# EasyEDA Pro project Flight Track V2.epro

# Schematic Schematic1
Board Name: Board1; Create Date: 2025-07-31; Page Name: P1_1; Project Name: RC Plane Flight Computer V2; Schematic Name: Schematic1; Update Date: 2025-07-31; Company: EasyEDA.com; Page Size: A4; Version: V1.0
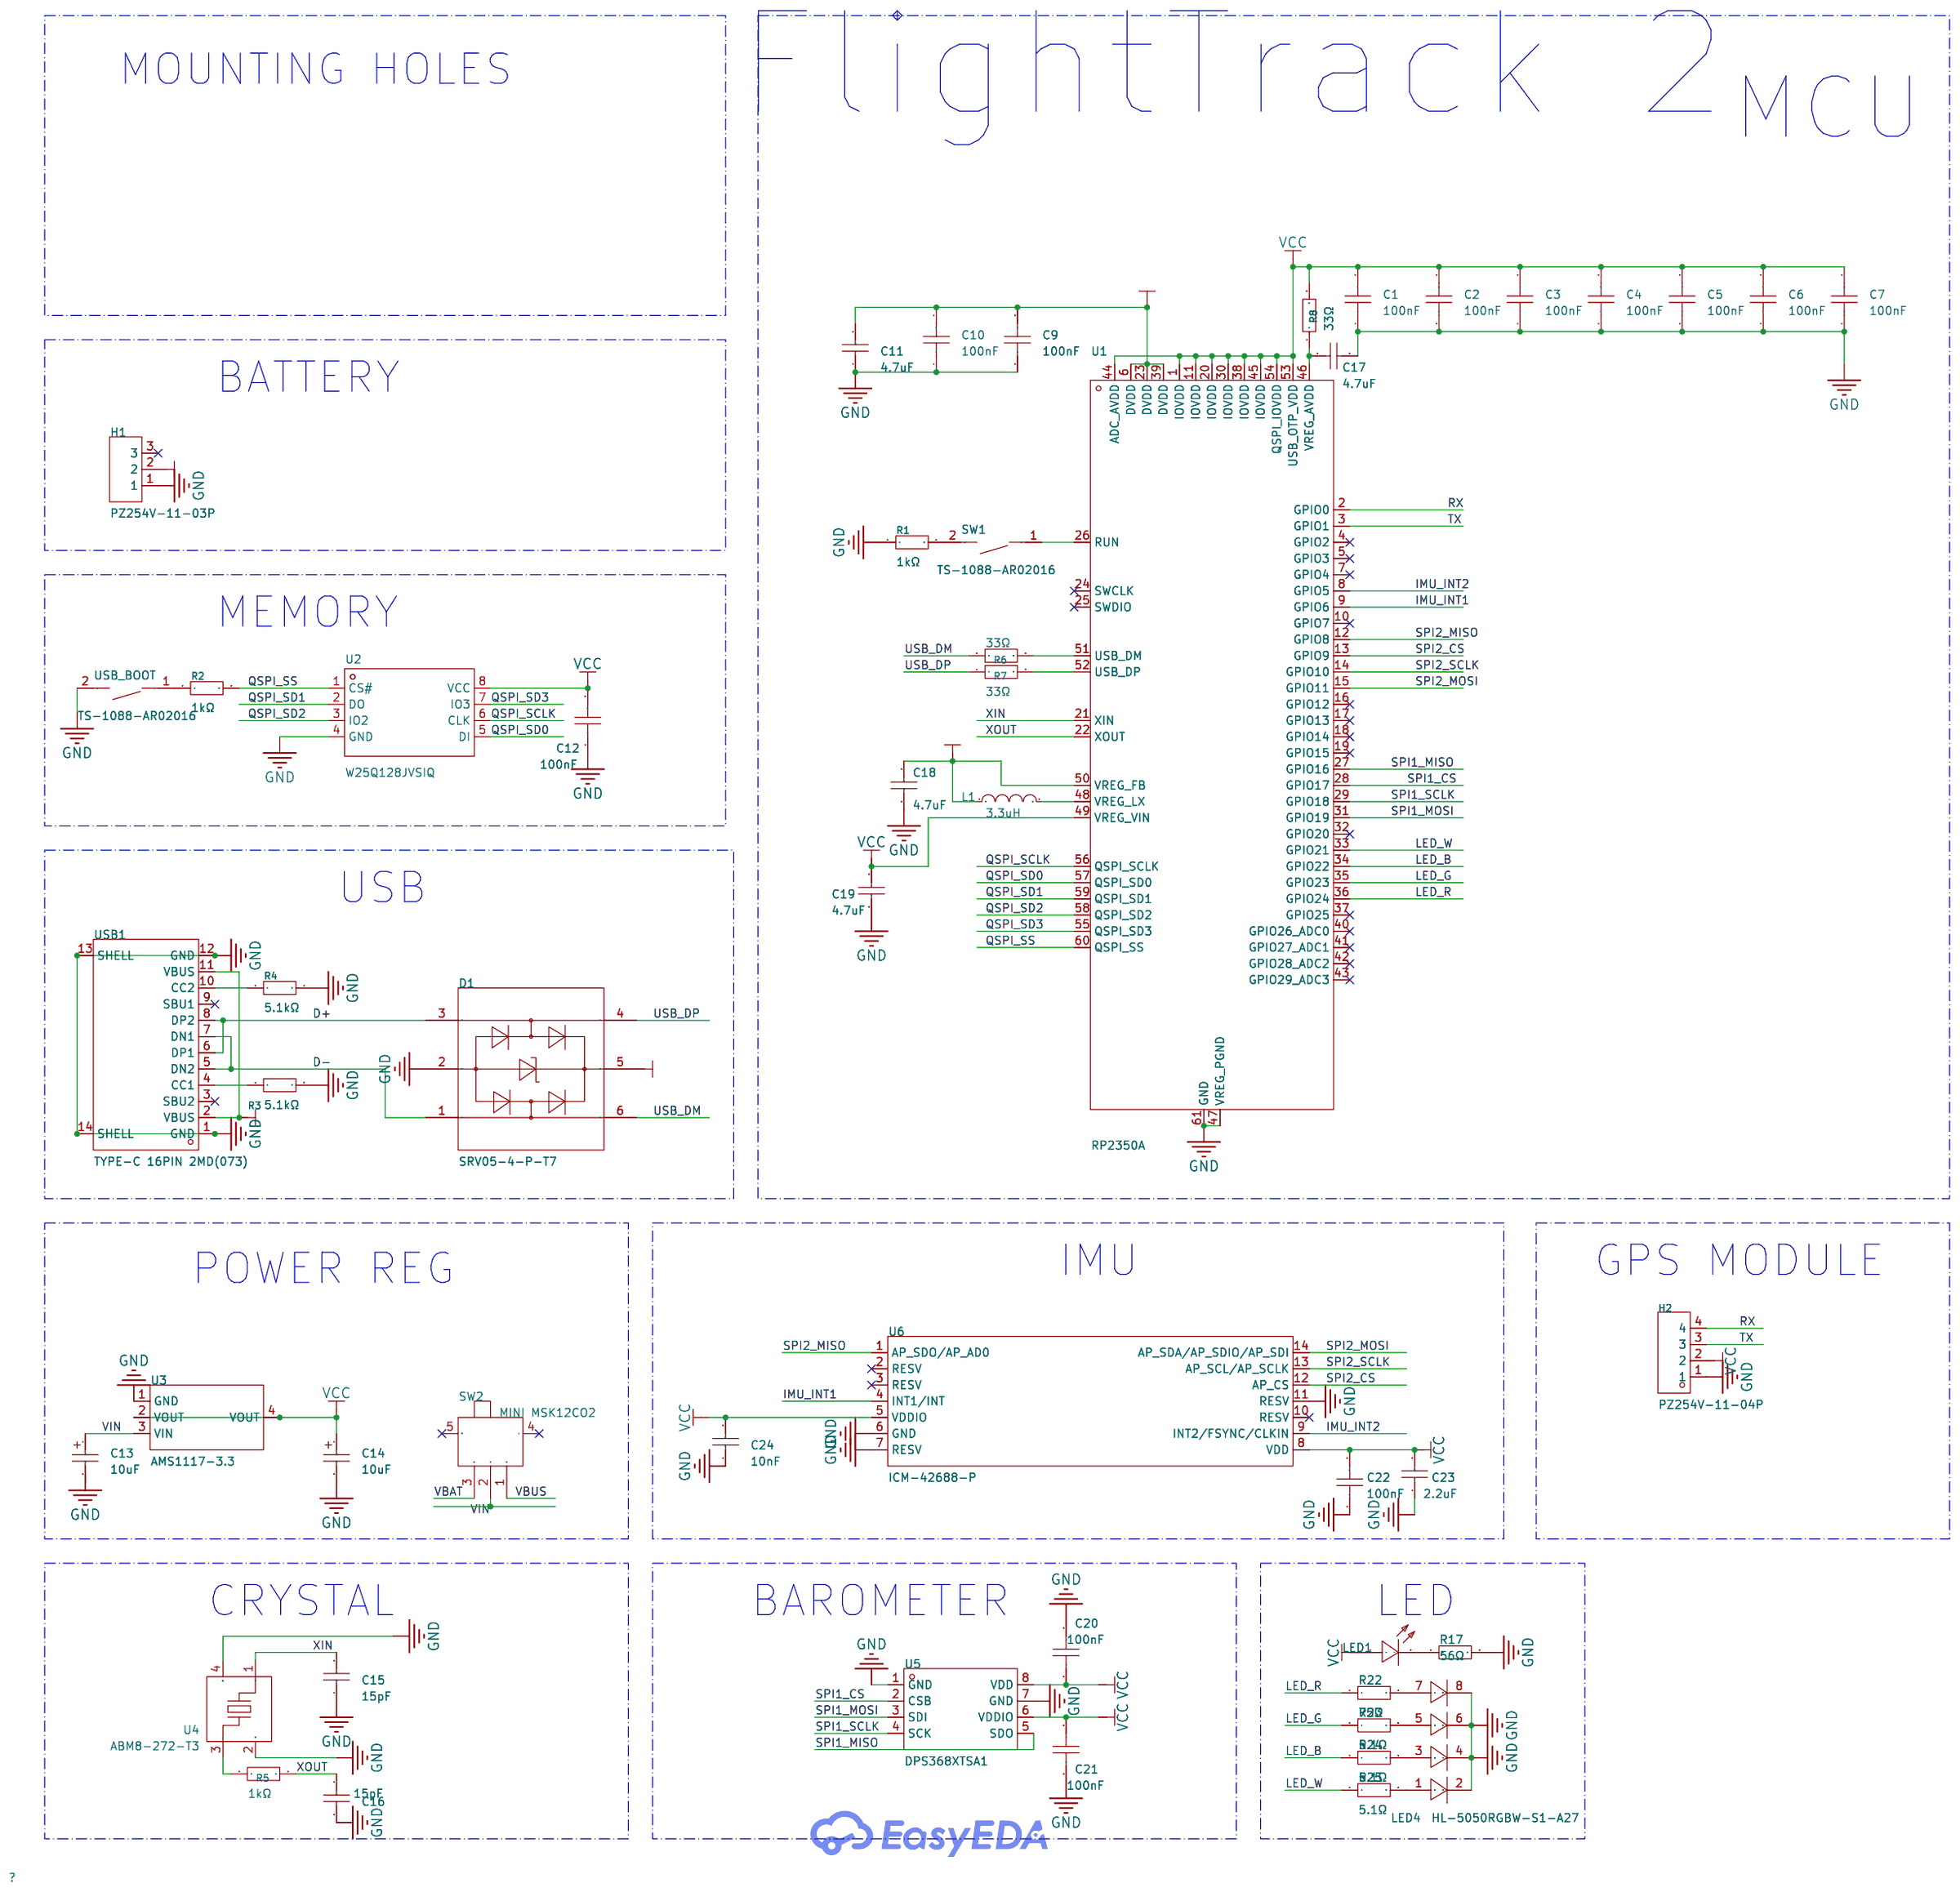
[diagram p0: schematic sheet]

## Parts
C1  100nF  [C0402]
C2  100nF  [C0402]
C3  100nF  [C0402]
C4  100nF  [C0402]
C5  100nF  [C0402]
C6  100nF  [C0402]
C7  100nF  [C0402]
C9  100nF  [C0402]
C10  100nF  [C0402]
C11  4.7uF  [C0805]
C12  100nF  [C0603]
C13  10uF  [CAP-SMD_L3.2-W1.6-RD-C7171]
C14  10uF  [CAP-SMD_L3.2-W1.6-RD-C7171]
C15  15pF  [C0402]
C16  15pF  [C0402]
C17  4.7uF  [C0805]
C18  4.7uF  [C0805]
C19  4.7uF  [C0805]
C20  100nF  [C0402]
C21  100nF  [C0402]
C22  100nF  [C0402]
C23  2.2uF  [C0603]
C24  10nF  [C0402]
D1  SRV05-4-P-T7  [SOT-23-6_L2.9-W1.6-P0.95-LS2.8-BR]
H1  PZ254V-11-03P  [HDR-TH_3P-P2.54-V-M]
H2  PZ254V-11-04P  [HDR-TH_4P-P2.54-V-M]
L1  3.3uH  [L0603]
LED1  NCD0805R1  [LED0805-R-RD]
LED4  HL-5050RGBW-S1-A27  [LED-SMD_8P-L5.0-W5.0-P1.20_HL-5050RGBW-S1-A27]
R1  1kΩ  [R0402]
R2  1kΩ  [R0402]
R3  5.1kΩ  [R0402]
R4  5.1kΩ  [R0402]
R5  1kΩ  [R0402]
R6  33Ω  [R0402]
R7  33Ω  [R0402]
R8  33Ω  [R0402]
R17  56Ω  [R0603]
R22  75Ω  [R0603]
R23  5.1Ω  [R0603]
R24  5.1Ω  [R0603]
R25  5.1Ω  [R0603]
SW1  TS-1088-AR02016  [SW-SMD_L3.9-W3.0-P4.45]
SW2  MINI MSK12CO2  [SW-SMD_MSK12CO2]
U1  RP2350A  [QFN-60_L7.0-W7.0-P0.40-TL-EP3.4]
U2  W25Q128JVSIQ  [SOIC-8_L5.3-W5.3-P1.27-LS8.0-BL]
U3  AMS1117-3.3  [SOT-223-3_L6.5-W3.4-P2.30-LS7.0-BR]
U4  ABM8-272-T3  [CRYSTAL-SMD_4P-L3.2-W2.5-BL]
U5  DPS368XTSA1  [LGA-8_L2.5-W2.0-P0.65-TR_DPS368]
U6  ICM-42688-P  [LGA-14_L3.0-W2.5-P0.50-TL]
USB1  TYPE-C 16PIN 2MD(073)  [USB-C-SMD_TYPE-C-6PIN-2MD-073]
USB_BOOT  TS-1088-AR02016  [SW-SMD_L3.9-W3.0-P4.45]

## Library data of the parts
C1-C7 C9 C10 C20-C22 = CL05B104KO5NNNC: Capacitance: Tolerance:±10% Tolerance:±10% Voltage Rated: Temperature Coefficient:; LCSC Part Name: 100nF ±10% 16V; Supplier Part: C1525; Manufacturer: SAMSUNG(三星); Supplier Footprint: 0402; JLCPCB Part Class: Basic Part; Datasheet: https://atta.szlcsc.com/upload/public/pdf/source/20160218/1457707763339.pdf; Supplier: LCSC; Tolerance: ±10%
C11 C17-C19 = CL21A475KAQNNNE: Capacitance: Tolerance:±10% Tolerance:±10% Voltage Rated: Temperature Coefficient:; LCSC Part Name: 4.7uF ±10% 25V; Supplier Part: C1779; Manufacturer: SAMSUNG(三星); Supplier Footprint: 0805; JLCPCB Part Class: Basic Part; Datasheet: https://atta.szlcsc.com/upload/public/pdf/source/20160218/1457707763339.pdf; Supplier: LCSC; Tolerance: ±10%
C12 = CC0603KRX7R9BB104: Capacitance:100nF Tolerance:±10% Tolerance:±10% Voltage Rating:50V Temperature Coefficient:X7R; LCSC Part Name: 100nF ±10% 50V; Supplier Part: C14663; Manufacturer: YAGEO(国巨); Supplier Footprint: 0603; JLCPCB Part Class: Basic Part; Datasheet: https://atta.szlcsc.com/upload/public/pdf/source/20250214/096C4C206003071F5D32E5F0D8E7F8DF.pdf; Supplier: LCSC; Tolerance: ±10%; Voltage Rating: 50V; Temperature Coefficient: X7R
C13 C14 = TAJA106K016RNJ: Capacitance:10uF Tolerance:±10% Tolerance:±10% Voltage Rating:16V Equivalent Series Resistance(ESR):3Ω@100kHz Operating Temperature:-55℃~+125℃ Operating Temperature:-55℃~+125℃; LCSC Part Name: 10uF ±10% 16V; Supplier Part: C7171; Manufacturer: Kyocera AVX; Supplier Footprint: CASE-A-3216-18(mm); JLCPCB Part Class: Basic Part; Supplier: LCSC; Tolerance: ±10%; Voltage Rating: 16V; Equivalent Series Resistance(ESR): 3Ω@100kHz; Operating Temperature: -55℃~+125℃
C15 C16 = 0402CG150J500NT: Capacitance: Tolerance:±5% Tolerance:±5% Voltage Rated: Temperature Coefficient:; LCSC Part Name: 15pF ±5% 50V; Supplier Part: C1548; Manufacturer: FH(风华); Supplier Footprint: 0402; JLCPCB Part Class: Basic Part; Datasheet: https://atta.szlcsc.com/upload/public/pdf/source/20200305/C486355_26A10D38EF8C2A5C37091D0039909270.pdf; Supplier: LCSC; Tolerance: ±5%
C23 = CL10A225KO8NNNC: Capacitance: Tolerance:±10% Tolerance:±10% Voltage Rated: Temperature Coefficient:; LCSC Part Name: 2.2uF ±10% 16V; Supplier Part: C23630; Manufacturer: SAMSUNG(三星); Supplier Footprint: 0603; JLCPCB Part Class: Basic Part; Datasheet: https://atta.szlcsc.com/upload/public/pdf/source/20160218/1457707763339.pdf; Supplier: LCSC; Tolerance: ±10%
C24 = CL05B103KB5NNNC: Capacitance: Tolerance:±10% Tolerance:±10% Voltage Rated: Temperature Coefficient:; LCSC Part Name: 10nF ±10% 50V; Supplier Part: C15195; Manufacturer: SAMSUNG(三星); Supplier Footprint: 0402; JLCPCB Part Class: Basic Part; Datasheet: https://atta.szlcsc.com/upload/public/pdf/source/20160218/1457707763339.pdf; Supplier: LCSC; Tolerance: ±10%
D1 = SRV05-4-P-T7_C19829547: Supplier Part: C19829547; Manufacturer: TECH PUBLIC(台舟); Supplier Footprint: SOT-23-6; JLCPCB Part Class: Extended Part; Datasheet: https://atta.szlcsc.com/upload/public/pdf/source/20240119/64597E192DDDD3DD737332EA0EAB363F.pdf; Supplier: LCSC
H1 = PZ254V-11-03P: Pin Structure:1x3P Pitch:2.54mm Row Spacing:- Circluar Pins/Square Pins:Policy Mounting Type:Straight Number of Rows:Single Row Number of Pins:3P Current Rating:3A Voltage Rating (Max):250V Length of Mating Pin:6mm Insulation Height:2.5mm Length of End Co; LCSC Part Name: 1x3P 间距:2.54mm 方针 直插; Supplier Part: C2937625; Manufacturer: XFCN(兴飞); Supplier Footprint: 插件,P=2.54mm; JLCPCB Part Class: Extended Part; Datasheet: https://atta.szlcsc.com/upload/public/pdf/source/20200309/C492402_8335C3D49C4E4C618838D59BB1D024C1.pdf; Supplier: LCSC; Pin Structure: 1x3P; Pitch: 2.54mm; Circluar Pins/Square Pins: Policy; Mounting Type: Straight; Number of Rows: Single Row; Number of Pins: 3P; Current Rating: 3A; Voltage Rating (Max): 250V; Length of Mating Pin: 6mm; Insulation Height: 2.5mm; Length of End Connection Pin: 3mm; Operating Temperature: -40℃~+105℃; Color: Black
H2 = PZ254V-11-04P: Pin Structure:1x4P Pitch:2.54mm Row Spacing:- Circluar Pins/Square Pins:Square Pins Mounting Type:Straight Number of Rows:Plugin Number of Pins:4P Current Rating (Max):3A Voltage Rating (Max):250V Length of Mating Pin:6mm Insulation Height:2.5mm Length of; LCSC Part Name: 间距:2.54mm 1x4P 直插 方针; Supplier Part: C2691448; Manufacturer: XFCN(兴飞); Supplier Footprint: 插件,P=2.54mm; JLCPCB Part Class: Extended Part; Datasheet: https://atta.szlcsc.com/upload/public/pdf/source/20200309/C492403_F9F19131791D08044AD4F84F8E751A34.pdf; Supplier: LCSC; Pin Structure: 1x4P; Pitch: 2.54mm; Circluar Pins/Square Pins: Square Pins; Mounting Type: Straight; Number of Rows: Plugin; Number of Pins: 4P; Current Rating (Max): 3A; Voltage Rating (Max): 250V; Length of Mating Pin: 6mm; Insulation Height: 2.5mm; Length of End Connection Pin: 3mm; Operating Temperature Range: -40℃~+105℃; Color: Black
L1 = CMI160808U3R3KT: Inductance: Tolerance:±10% Tolerance:±10% Rated Current: Saturation Current (Isat):- DC Resistance (DCR): Q @ Freq:- Frequency - Self Resonant:- Ratings:; LCSC Part Name: 3.3uH ±10%; Supplier Part: C139209; Manufacturer: FH(风华); Supplier Footprint: 0603; JLCPCB Part Class: Extended Part; Datasheet: https://atta.szlcsc.com/upload/public/pdf/source/20230223/55F203729CE6F04E1707F35DF12034EB.pdf; Supplier: LCSC; Tolerance: ±10%
LED1 = NCD0805R1_C84256: Lamp Holder Type:- Emitted Color:Red Forward Voltage (VF):1.6V~2.6V Forward Voltage (VF):1.6V~2.6V Power Dissipation:65mW Forward Current:20mA Dominant Wavelength:615nm~630nm Dominant Wavelength:615nm~630nm Peak Wavelength:- Diode Configuration:独立二极管 Lens; Supplier Part: C84256; Manufacturer: 国星光电; Supplier Footprint: 0805; JLCPCB Part Class: Basic Part; Datasheet: https://atta.szlcsc.com/upload/public/pdf/source/20200820/C84256_F0A75A43B3EAD75808600A0514C76B99.pdf; Supplier: LCSC; Emitted Color: Red; Forward Voltage (VF): 1.6V~2.6V; Power Dissipation: 65mW; Forward Current: 20mA; Dominant Wavelength: 615nm~630nm; Diode Configuration: 独立二极管; Lens Color: 无色透明透镜; Luminous Intensity: 67mcd~195mcd; Viewing Angle: 130°; Operating Temperature: -30℃~+85℃
LED4 = HL-5050RGBW-S1-A27: Supplier Part: C22470444; Manufacturer: HONGLITRONIC(鸿利光电); Supplier Footprint: SMD5050-8P; JLCPCB Part Class: Extended Part; Datasheet: https://atta.szlcsc.com/upload/public/pdf/source/20240621/CDBFEAC4FBA141F7EE03B635C29BD5DB.pdf; Supplier: LCSC
R1 R2 R5 = 0402WGF1001TCE: Type:Thick Film Resistors Resistance:1kΩ Tolerance:±1% Tolerance:±1% Power(Watts): Overload Voltage (Max): Temperature Coefficient:±100ppm/℃ Temperature Coefficient:±100ppm/℃ Operating Temperature Range:-55℃~+155℃ Operating Temperature Range:-55℃~+155℃; LCSC Part Name: 1kΩ ±1% 62.5mW 厚膜电阻; Supplier Part: C11702; Manufacturer: UNI-ROYAL(厚声); Supplier Footprint: 0402; JLCPCB Part Class: Basic Part; Datasheet: https://atta.szlcsc.com/upload/public/pdf/source/20200306/C422600_1E6D84923E4A46A82E41ADD87F860B5C.pdf; Supplier: LCSC; Type: Thick Film Resistors; Tolerance: ±1%; Temperature Coefficient: ±100ppm/℃; Operating Temperature Range: -55℃~+155℃
R3 R4 = 0402WGF5101TCE: Type:Thick Film Resistors Resistance:5.1kΩ Tolerance:±1% Tolerance:±1% Power(Watts): Overload Voltage (Max): Temperature Coefficient:±100ppm/℃ Temperature Coefficient:±100ppm/℃ Operating Temperature Range:-55℃~+155℃ Operating Temperature Range:-55℃~+155℃; LCSC Part Name: 5.1kΩ ±1% 62.5mW 厚膜电阻; Supplier Part: C25905; Manufacturer: UNI-ROYAL(厚声); Supplier Footprint: 0402; JLCPCB Part Class: Basic Part; Datasheet: https://atta.szlcsc.com/upload/public/pdf/source/20200306/C422600_1E6D84923E4A46A82E41ADD87F860B5C.pdf; Supplier: LCSC; Type: Thick Film Resistors; Tolerance: ±1%; Temperature Coefficient: ±100ppm/℃; Operating Temperature Range: -55℃~+155℃
R6-R8 = 0402WGF330JTCE: Type:Thick Film Resistors Resistance:33Ω Tolerance:±1% Tolerance:±1% Power(Watts): Overload Voltage (Max): Temperature Coefficient:±100ppm/℃ Temperature Coefficient:±100ppm/℃ Operating Temperature Range:-55℃~+155℃ Operating Temperature Range:-55℃~+155℃; LCSC Part Name: 33Ω ±1% 62.5mW 厚膜电阻; Supplier Part: C25105; Manufacturer: UNI-ROYAL(厚声); Supplier Footprint: 0402; JLCPCB Part Class: Basic Part; Datasheet: https://atta.szlcsc.com/upload/public/pdf/source/20200306/C422600_1E6D84923E4A46A82E41ADD87F860B5C.pdf; Supplier: LCSC; Type: Thick Film Resistors; Tolerance: ±1%; Temperature Coefficient: ±100ppm/℃; Operating Temperature Range: -55℃~+155℃
R17 = 0603WAF560JT5E: Type:Thick Film Resistors Resistance:56Ω Tolerance:±1% Tolerance:±1% Power(Watts): Overload Voltage (Max): Temperature Coefficient:±200ppm/℃ Temperature Coefficient:±200ppm/℃ Operating Temperature Range:-55℃~+155℃ Operating Temperature Range:-55℃~+155℃; LCSC Part Name: 56Ω ±1% 100mW 厚膜电阻; Supplier Part: C25196; Manufacturer: UNI-ROYAL(厚声); Supplier Footprint: 0603; JLCPCB Part Class: Extended Part; Datasheet: https://atta.szlcsc.com/upload/public/pdf/source/20200306/C422600_1E6D84923E4A46A82E41ADD87F860B5C.pdf; Supplier: LCSC; Type: Thick Film Resistors; Tolerance: ±1%; Temperature Coefficient: ±200ppm/℃; Operating Temperature Range: -55℃~+155℃
R22 = 0603WAF750JT5E: Type:Thick Film Resistor Resistance:75Ω Tolerance:±1% Tolerance:±1% Power(Watts):100mW Voltage-Supply(Max):75V Temperature Coefficient:±100ppm/℃ Temperature Coefficient:±100ppm/℃ Operating Temperature:-55℃~+155℃ Operating Temperature:-55℃~+155℃; LCSC Part Name: 75Ω ±1% 100mW 厚膜电阻; Supplier Part: C4275; Manufacturer: UNI-ROYAL(厚声); Supplier Footprint: 0603; JLCPCB Part Class: Basic Part; Datasheet: https://atta.szlcsc.com/upload/public/pdf/source/20200306/C422600_1E6D84923E4A46A82E41ADD87F860B5C.pdf; Supplier: LCSC; Type: Thick Film Resistor; Tolerance: ±1%; Power(Watts): 100mW; Voltage-Supply(Max): 75V; Temperature Coefficient: ±100ppm/℃; Operating Temperature: -55℃~+155℃
R23-R25 = 0603WAF510KT5E: Type:Thick Film Resistors Resistance:5.1Ω Tolerance:±1% Tolerance:±1% Power(Watts): Overload Voltage (Max): Temperature Coefficient:±200ppm/℃ Temperature Coefficient:±200ppm/℃ Operating Temperature Range:-55℃~+155℃ Operating Temperature Range:-55℃~+155℃; LCSC Part Name: 5.1Ω ±1% 100mW 厚膜电阻; Supplier Part: C25197; Manufacturer: UNI-ROYAL(厚声); Supplier Footprint: 0603; JLCPCB Part Class: Basic Part; Datasheet: https://atta.szlcsc.com/upload/public/pdf/source/20200306/C422600_1E6D84923E4A46A82E41ADD87F860B5C.pdf; Supplier: LCSC; Type: Thick Film Resistors; Tolerance: ±1%; Temperature Coefficient: ±200ppm/℃; Operating Temperature Range: -55℃~+155℃
SW1 USB_BOOT = TS-1088-AR02016: Circuit:SPST Actuator Style:Round Button Operating Force:160gf Mounting Style:Brick nogging Switch Length:4mm Switch Width:3mm Switch Height:2mm Strike Gundam:不带 Contact Current:50mA Voltage Rating (DC):12V Insulation Resistance:100MΩ Actuator/Cap Color:B; LCSC Part Name: 4*3*2mm 立贴 轻触开关; Supplier Part: C720477; Manufacturer: XUNPU(讯普); Supplier Footprint: SMD; JLCPCB Part Class: Basic Part; Datasheet: https://atta.szlcsc.com/upload/public/pdf/source/20200810/C720475_60D09DD6C54279ADDB2DC25100F1CC11.pdf; Supplier: LCSC; Circuit: SPST; Actuator Style: Round Button; Operating Force: 160gf; Mounting Style: Brick nogging; Switch Length: 4mm; Switch Width: 3mm; Switch Height: 2mm; Strike Gundam: 不带; Contact Current: 50mA; Voltage Rating (DC): 12V; Insulation Resistance: 100MΩ; Actuator/Cap Color: Black; Pin Style: SMDSplicing; Mechanical Life: 10万次; Operating Temperature: -30℃~+80℃
SW2 = MINI MSK12CO2: Circuit:SPDT Actuator Style:- Pin Style:SMDSplicing Switch Length:5mm Switch Width:2.75mm Switch Height:1.4mm Mounting Style:卧贴 Actuator Color:- Current Rating (DC):50mA Voltage Rating (DC):12V Current Rating (AC):- Voltage Rating (AC):- Mechanical Life:1; LCSC Part Name: 迷你七脚两档侧拨拨动 mini七7脚 微型拨动; Supplier Part: C2681570; Manufacturer: SHOU HAN(首韩); Supplier Footprint: SMD; JLCPCB Part Class: Extended Part; Datasheet: https://atta.szlcsc.com/upload/public/pdf/source/20210224/C2681570_D263F9C605E4588A4AE6114B72AE4C72.pdf; Supplier: LCSC; Circuit: SPDT; Pin Style: SMDSplicing; Switch Length: 5mm; Switch Width: 2.75mm; Switch Height: 1.4mm; Mounting Style: 卧贴; Current Rating (DC): 50mA; Voltage Rating (DC): 12V; Mechanical Life: 1万次; Operating Temperature: -16℃~+60℃
U1 = RP2350A_C42411118: Supplier Part: C42411118; Manufacturer: Raspberry Pi(树莓派); Supplier Footprint: QFN-60-EP(7x7); JLCPCB Part Class: Extended Part; Datasheet: https://atta.szlcsc.com/upload/public/pdf/source/20241210/0989AB86AAD7A21936E5CD12ADC9EA29.pdf; Supplier: LCSC
U2 = W25Q128JVSIQ: Interface Type:SPI Memory Size:128Mbit Clock Frequency (fc):133MHz Supply Voltage:2.7V~3.6V Supply Voltage:2.7V~3.6V Page Programming Time (Tpp):700us Block Erase Time (tBE):120ms@(32KB) Data Retention - TDR (Year):20 years Operating Temperature:-40℃~+85℃; LCSC Part Name: W25Q128JVSIQ 编带; Supplier Part: C97521; Manufacturer: WINBOND(华邦); Supplier Footprint: SOIC-8-208mil; JLCPCB Part Class: Basic Part; Datasheet: https://atta.szlcsc.com/upload/public/pdf/source/20170316/1489627409956.pdf; Supplier: LCSC; Interface Type: SPI; Memory Size: 128Mbit; Clock Frequency (fc): 133MHz; Supply Voltage: 2.7V~3.6V; Page Programming Time (Tpp): 700us; Block Erase Time (tBE): 120ms@(32KB); Data Retention - TDR (Year): 20 years; Operating Temperature: -40℃~+85℃
U3 = AMS1117-3.3_C6186: Output Type:Fixed Voltage - Supply:16V Output Voltage:3.3V Output Voltage:3.3V Output Current:1A Power Supply Rejection Ratio (PSRR):72dB@(120Hz) Voltage Dropout:1.1V@(800mA) standby current:5mA Noise:- Features:Over Current Protection；Over Temperature Pr; LCSC Part Name: 输出3.3V 1A; Supplier Part: C6186; Manufacturer: AMS; Supplier Footprint: SOT-223; JLCPCB Part Class: Basic Part; Datasheet: https://atta.szlcsc.com/upload/public/pdf/source/20180727/C6186_7A095716F0823C02F1997A905E26C086.pdf; Supplier: LCSC; Output Type: Fixed; Voltage - Supply: 16V; Output Voltage: 3.3V; Output Current: 1A; Power Supply Rejection Ratio (PSRR): 72dB@(120Hz); Voltage Dropout: 1.1V@(800mA); standby current: 5mA; Features: Over Current Protection；Over Temperature Protection; Operating Temperature: -40℃~+125℃; Output Configuration: Positive; Number of Outputs: 1
U4 = ABM8-272-T3_C20625731: Supplier Part: C20625731; Manufacturer: ABRACON; Supplier Footprint: SMD3225-4P; JLCPCB Part Class: Extended Part; Datasheet: https://atta.szlcsc.com/upload/public/pdf/source/20240227/A8BE43F636D80F75C9AF5C59EDF21E9A.pdf; Supplier: LCSC
U5 = DPS368XTSA1: Pressure range:30Kpa~120Kpa Pressure range:30Kpa~120Kpa The Power Supply Voltage:1.7V~3.6V The Power Supply Voltage:1.7V~3.6V Operating Temperature:-40℃~+85℃ Operating Temperature:-40℃~+85℃; Supplier Part: C3232508; Manufacturer: Infineon(英飞凌); Supplier Footprint: VLGA-8(2x2.5); JLCPCB Part Class: Extended Part; Datasheet: https://atta.szlcsc.com/upload/public/pdf/source/20220812/DD997228859A2E6B5BE01B3E0ED58C18.pdf; Supplier: LCSC; Pressure range: 30Kpa~120Kpa; The Power Supply Voltage: 1.7V~3.6V; Operating Temperature: -40℃~+85℃
U6 = ICM-42688-P: Sensor Type:Accelerometer gyroscope; Supplier Part: C1850418; Manufacturer: TDK InvenSense(应美盛); Supplier Footprint: LGA-14(2.5x3); JLCPCB Part Class: Extended Part; Datasheet: https://atta.szlcsc.com/upload/public/pdf/source/20210703/CF24204867ACE5B754A2B035F23E5931.pdf; Supplier: LCSC; Sensor Type: Accelerometer gyroscope
USB1 = TYPE-C 16PIN 2MD(073): Connector Type:Type-C Protocol Standard:USB 3.1 Gender:Female Mounting Type:Surface Mount, Right Angle Number of Contacts:16P Number of Ports:1 Current Rating-Power:3A Voltage Rating:5V Connect-Disconnect Life:5,000 Cycles Supplementary Features:- Center; LCSC Part Name: Type-C 母 卧贴; Supplier Part: C2765186; Manufacturer: SHOU HAN(首韩); Supplier Footprint: SMD; JLCPCB Part Class: Extended Part; Datasheet: https://atta.szlcsc.com/upload/public/pdf/source/20250506/FFB74EDFDFA0AC372CE4A8E4F739CCEF.pdf; Supplier: LCSC; Connector Type: Type-C; Protocol Standard: USB 3.1; Gender: Female; Mounting Type: Surface Mount, Right Angle; Number of Contacts: 16P; Number of Ports: 1; Current Rating-Power: 3A; Voltage Rating: 5V; Connect-Disconnect Life: 5,000 Cycles; Detection color: Black; Operating Temperature: -25℃~+85℃

## Nets
1V1: C9.2 C10.2 C11.2 C18.2 L1.1 U1.6(DVDD) U1.23(DVDD) U1.39(DVDD) U1.50(VREG_FB)
GND: C1.1 C2.1 C3.1 C4.1 C5.1 C6.1 C7.1 C9.1 C10.1 C11.1 C12.1 C13.2 C14.2 C15.1 C16.1 C17.2 C18.1 C19.1 C20.2 C21.1 C22.1 C23.1 C24.1 D1.2 H1.1 H2.1 LED4.2 LED4.4 LED4.6 LED4.8 R1.1 R3.2 R4.2 R17.2 U1.47(VREG_PGND) U1.61(GND) U2.4(GND) U3.1(GND) U4.2(GND) U4.4(GND) U5.1(GND) U5.7(GND) U6.6(GND) U6.7(RESV) U6.11(RESV) USB1.1(GND) USB1.12(GND) USB1.13(SHELL) USB1.14(SHELL) USB_BOOT.2
VBAT: H1.2 SW2.3
VBUS: D1.5 SW2.1 USB1.2(VBUS) USB1.11(VBUS)
VCC: C1.2 C2.2 C3.2 C4.2 C5.2 C6.2 C7.2 C12.2 C14.1 C19.2 C20.1 C21.2 C22.2 C23.2 C24.2 H2.2 LED1.1(+) R8.2 U1.1(IOVDD) U1.11(IOVDD) U1.20(IOVDD) U1.30(IOVDD) U1.38(IOVDD) U1.44(ADC_AVDD) U1.45(IOVDD) U1.49(VREG_VIN) U1.53(USB_OTP_VDD) U1.54(QSPI_IOVDD) U2.8(VCC) U3.2(VOUT) U3.4(VOUT) U5.6(VDDIO) U5.8(VDD) U6.5(VDDIO) U6.8(VDD)
VIN: C13.1 SW2.2 U3.3(VIN)
D+: D1.3 USB1.6(DP1) USB1.8(DP2)
D-: D1.1 USB1.5(DN2) USB1.7(DN1)
IMU_INT1: U1.9(GPIO6) U6.4(INT1/INT)
IMU_INT2: U1.8(GPIO5) U6.9(INT2/FSYNC/CLKIN)
LED_B: R24.1 U1.34(GPIO22)
LED_G: R23.1 U1.35(GPIO23)
LED_R: R22.1 U1.36(GPIO24)
LED_W: R25.1 U1.33(GPIO21)
QSPI_SCLK: U1.56(QSPI_SCLK) U2.6(CLK)
QSPI_SD0: U1.57(QSPI_SD0) U2.5(DI)
QSPI_SD1: U1.59(QSPI_SD1) U2.2(DO)
QSPI_SD2: U1.58(QSPI_SD2) U2.3(IO2)
QSPI_SD3: U1.55(QSPI_SD3) U2.7(IO3)
QSPI_SS: R2.2 U1.60(QSPI_SS) U2.1(CS#)
RX: H2.4 U1.2(GPIO0)
SPI1_CS: U1.28(GPIO17) U5.2(CSB)
SPI1_MISO: U1.27(GPIO16) U5.5(SDO)
SPI1_MOSI: U1.31(GPIO19) U5.3(SDI)
SPI1_SCLK: U1.29(GPIO18) U5.4(SCK)
SPI2_CS: U1.13(GPIO9) U6.12(AP_CS)
SPI2_MISO: U1.12(GPIO8) U6.1(AP_SDO/AP_AD0)
SPI2_MOSI: U1.15(GPIO11) U6.14(AP_SDA/AP_SDIO/AP_SDI)
SPI2_SCLK: U1.14(GPIO10) U6.13(AP_SCL/AP_SCLK)
TX: H2.3 U1.3(GPIO1)
USB_DM: D1.6 R6.1
USB_DP: D1.4 R7.1
XIN: C15.2 U1.21(XIN) U4.1
XOUT: C16.2 R5.2 U1.22(XOUT)
$3N2040: SW1.1 U1.26(RUN)
$3N2079: R1.2 SW1.2
$3N3092: R2.1 USB_BOOT.1
$3N3395: R3.1 USB1.4(CC1)
$3N3399: R4.1 USB1.10(CC2)
$3N4615: R5.1 U4.3
$3N4980: R6.2 U1.51(USB_DM)
$3N4984: R7.2 U1.52(USB_DP)
$3N5159: C17.1 R8.1 U1.46(VREG_AVDD)
$3N5414: L1.2 U1.48(VREG_LX)
$3N15012: LED1.2(-) R17.1
Net-(LED4-1): LED4.1 R25.2
Net-(LED4-3): LED4.3 R24.2
Net-(LED4-5): LED4.5 R23.2
Net-(LED4-7): LED4.7 R22.2

Not connected (* = marked no-connect by the designer): H1 3*; SW2 4* 5*; U1 4(GPIO2)* 5(GPIO3)* 7(GPIO4)* 10(GPIO7)* 16(GPIO12)* 17(GPIO13)* 18(GPIO14)* 19(GPIO15)* 24(SWCLK)* 25(SWDIO)* 32(GPIO20)* 37(GPIO25)* 40(GPIO26_ADC0)* 41(GPIO27_ADC1)* 42(GPIO28_ADC2)* 43(GPIO29_ADC3)*; U6 2(RESV)* 3(RESV)* 10(RESV)*; USB1 3(SBU2)* 9(SBU1)*

## Notes on the sheet
- FlightTrack 2
- MOUNTING HOLES
- MCU
- BATTERY
- MEMORY
- USB
- POWER REG
- IMU
- GPS MODULE
- CRYSTAL
- BAROMETER
- LED

# Board PCB1
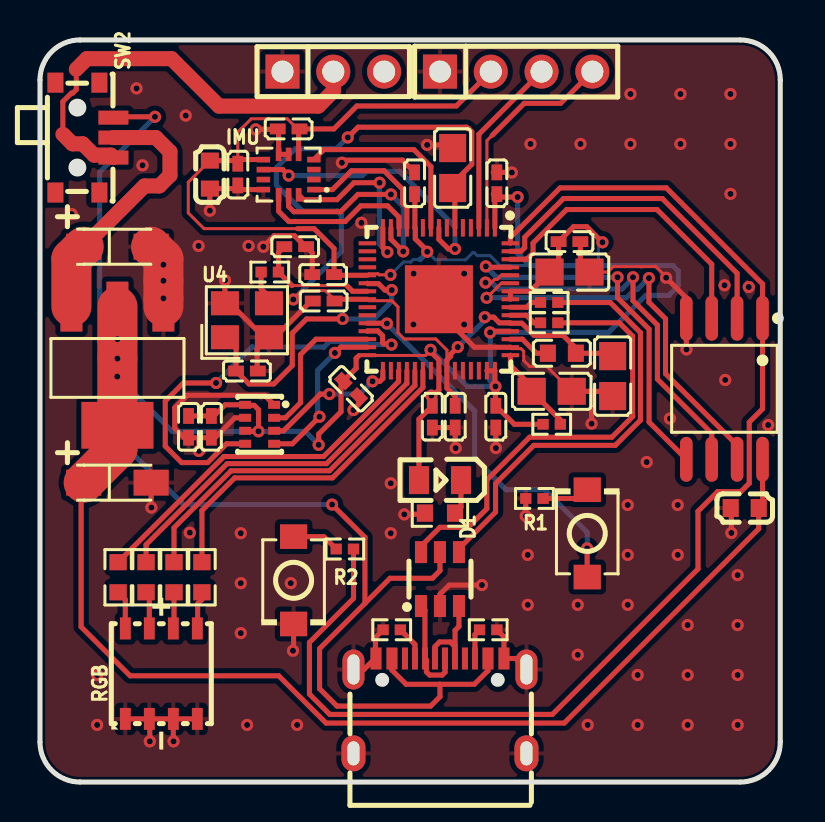
[diagram p1: board, top side]
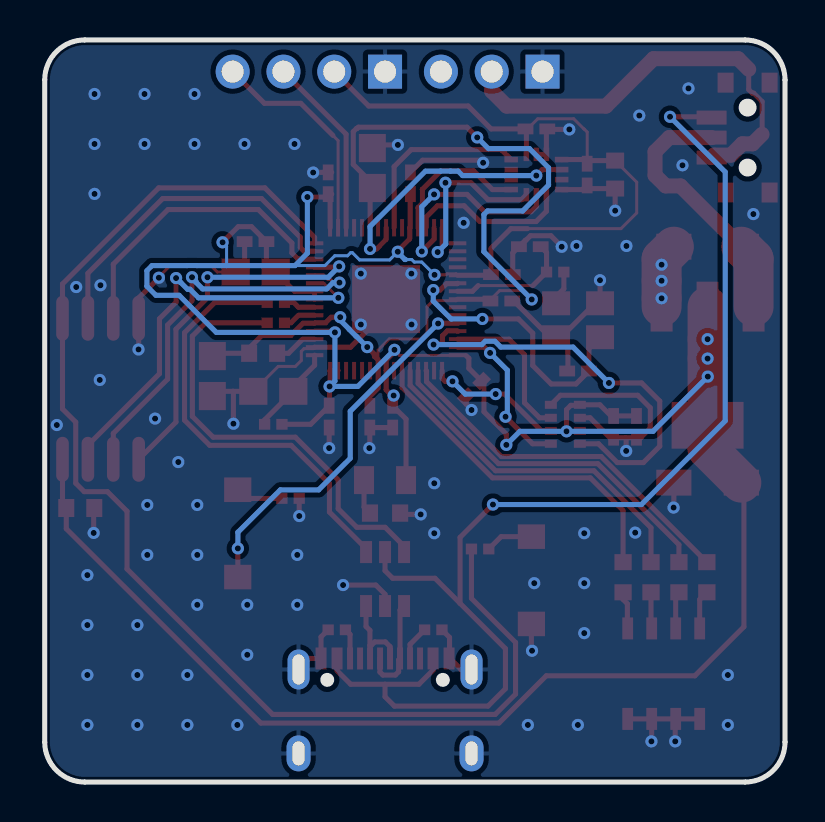
[diagram p2: board, bottom side, seen from below]

Outline 37.02 x 37.14 mm; copper layers: Top Layer, Bottom Layer. Coordinates in mm from the lower left corner of the outline.
Outline path: 0,35.14 0,2 arc(0.59,0.59) 2,0 35.02,0 arc(36.43,0.59) 37.02,2 37.02,35.14 arc(36.43,36.56) 35.02,37.14 2,37.14 arc(0.59,36.56) 0,35.14
Stack: Top Layer 0.035mm / Dielectric1 1.51mm FR4 er 4.5 / Bottom Layer 0.035mm

## Design rules (mm)
template: JLCPCB Capability(Two Layers Board)
spacing copperThickness1oz (default): track to track 0.102, other pairs 0.152 to 0.3
spacing copperThickness2oz: track to track 0.203, other pairs 0.152 to 0.3
track width copperThickness1oz (default): min 0.127, default 0.254, max 2.54
track width copperThickness2oz: min 0.203, default 0.254, max 2.54
differential pair differentialPair (default): width min 0.127, default 0.254, max 2.54; gap min 0.152, default 0.152
via viaSize (default): diameter min 0.5, default 0.61, max 10; hole min 0.3, default 0.305, max 6.3

## Placement (name value [footprint] x y rotation side)
C1  100nF  [C0402]  22.84 29.97 270 top
C2  100nF  [C0402]  18.73 29.97 270 top
C3  100nF  [C0402]  14.16 25.4 0 top
C4  100nF  [C0402]  19.62 18.29 90 top
C5  100nF  [C0402]  22.79 18.29 90 top
C6  100nF  [C0402]  26.48 27.05 180 top
C7  100nF  [C0402]  15.56 19.69 135 top
C9  100nF  [C0402]  20.76 18.29 90 top
C10  100nF  [C0402]  14.18 24.08 0 top
C11  4.7uF  [C0805]  20.63 30.73 270 top
C12  100nF  [C0603]  35.24 13.72 0 top
C13  10uF  [CAP-SMD_L3.2-W1.6-RD-C7171]  3.87 26.8 0 top
C14  10uF  [CAP-SMD_L3.2-W1.6-RD-C7171]  3.87 14.99 0 top
C15  15pF  [C0402]  10.35 20.57 180 top
C16  15pF  [C0402]  12.76 26.8 180 top
C17  4.7uF  [C0805]  25.59 19.56 0 top
C18  4.7uF  [C0805]  28.64 20.32 90 top
C19  4.7uF  [C0805]  26.48 25.53 180 top
C20  100nF  [C0402]  8.57 17.78 270 top
C21  100nF  [C0402]  7.43 17.78 90 top
C22  100nF  [C0402]  9.89 30.41 90 top
C23  2.2uF  [C0603]  8.5 30.41 90 top
C24  10nF  [C0402]  12.43 32.69 0 top
D1  SRV05-4-P-T7  [SOT-23-6_L2.9-W1.6-P0.95-LS2.8-BR]  20 10.16 270 top
H1  PZ254V-11-03P  [HDR-TH_3P-P2.54-V-M]  14.67 35.56 0 top
H2  PZ254V-11-04P  [HDR-TH_4P-P2.54-V-M]  23.81 35.56 0 top
IMU  ICM-42688-P  [LGA-14_L3.0-W2.5-P0.50-TL]  12.43 30.41 180 top
L1  3.3uH  [L0603]  26.1 21.46 180 top
LED1  NCD0805R1  [LED0805-R-RD]  20 15.11 180 top
R1  1kΩ  [R0402]  24.72 14.19 0 top
R2  1kΩ  [R0402]  15.25 11.66 0 top
R3  5.1kΩ  [R0402]  17.59 7.62 180 top
R4  5.1kΩ  [R0402]  22.41 7.62 0 top
R5  1kΩ  [R0402]  11.49 25.53 0 top
R6  33Ω  [R0402]  25.46 22.99 180 top
R7  33Ω  [R0402]  25.46 24 180 top
R8  33Ω  [R0402]  25.59 17.91 180 top
R17  56Ω  [R0603]  20 13.46 180 top
R22  75Ω  [R0603]  8.1 10.25 270 top
R23  5.1Ω  [R0603]  6.7 10.25 270 top
R24  5.1Ω  [R0603]  5.3 10.25 270 top
R25  5.1Ω  [R0603]  3.91 10.25 270 top
RGB  HL-5050RGBW-S1-A27  [LED-SMD_8P-L5.0-W5.0-P1.20_HL-5050RGBW-S1-A27]  6.07 5.42 90 top
SW1  TS-1088-AR02016  [SW-SMD_L3.9-W3.0-P4.45]  27.37 12.45 90 top
SW2  MINI MSK12CO2  [SW-SMD_MSK12CO2]  2.22 32.26 270 top
U1  RP2350A  [QFN-60_L7.0-W7.0-P0.40-TL-EP3.4]  19.95 24.17 270 top
U2  W25Q128JVSIQ  [SOIC-8_L5.3-W5.3-P1.27-LS8.0-BL]  34.22 19.69 180 top
U3  AMS1117-3.3  [SOT-223-3_L6.5-W3.4-P2.30-LS7.0-BR]  3.87 20.83 90 top
U4  ABM8-272-T3  [CRYSTAL-SMD_4P-L3.2-W2.5-BL]  10.35 23.11 0 top
U5  DPS368XTSA1  [LGA-8_L2.5-W2.0-P0.65-TR_DPS368]  10.98 17.91 0 top
USB1  TYPE-C 16PIN 2MD(073)  [USB-C-SMD_TYPE-C-6PIN-2MD-073]  20 3.81 0 top
USB_BOOT  TS-1088-AR02016  [SW-SMD_L3.9-W3.0-P4.45]  12.68 10.1 270 top

## Footprints (pads in the part's own frame, mm; a bottom-side part is the same pattern mirrored in y, then rotated)
C0402
  rect 0.79x0.54 smd: 1(-0.545,0) 2(0.545,0)
C0603
  rect 0.8x0.9 smd: 1(-0.7,0) 2(0.7,0)
C0805
  rect 1.41x1.35 smd: 1(-1,0) 2(1,0)
CAP-SMD_L3.2-W1.6-RD-C7171
  rect 1.758x1.296 smd: 1(-1.687,0) 2(1.687,0)
CRYSTAL-SMD_4P-L3.2-W2.5-BL
  rect 1.4x1.2 smd: 1(-1.1,-0.85) 2(1.1,-0.85) 3(1.1,0.85) 4(-1.1,0.85)
HDR-TH_3P-P2.54-V-M
  rect 1.7x1.7 hole 1.1: 1(-2.54,0)
  round 1.7 hole 1.1: 2(0,0) 3(2.54,0)
HDR-TH_4P-P2.54-V-M
  rect 1.7x1.7 hole 1.1: 1(-3.81,0)
  round 1.7 hole 1.1: 2(-1.27,0) 3(1.27,0) 4(3.81,0)
L0603
  rect 0.8x0.864 smd: 1(-0.7,0) 2(0.7,0)
LED0805-R-RD
  rect 1x1.399 smd: 1(1.05,0) 2(-1.05,0)
LED-SMD_8P-L5.0-W5.0-P1.20_HL-5050RGBW-S1-A27
  rect 1.1x0.54 smd: 1(2.265,1.8) 2(-2.265,1.8) 3(2.265,0.6) 4(-2.265,0.6) 5(2.265,-0.6) 6(-2.265,-0.6) 7(2.265,-1.8) 8(-2.265,-1.8)
LGA-8_L2.5-W2.0-P0.65-TR_DPS368
  rect 0.6x0.4 smd: 1(0.725,0.975) 2(0.725,0.325) 3(0.725,-0.325) 4(0.725,-0.975) 5(-0.725,-0.975) 6(-0.725,-0.325) 7(-0.725,0.325) 8(-0.725,0.975)
LGA-14_L3.0-W2.5-P0.50-TL
  rect 0.675x0.28 smd: 1(-1.262,0.75) 2(-1.262,0.25) 3(-1.262,-0.25) 4(-1.262,-0.75) 8(1.262,-0.75) 9(1.262,-0.25) 10(1.262,0.25) 11(1.262,0.75)
  rect 0.28x0.675 smd: 5(-0.5,-1.012) 6(0,-1.012) 7(0.5,-1.012) 12(0.5,1.012) 13(0,1.012) 14(-0.5,1.012)
QFN-60_L7.0-W7.0-P0.40-TL-EP3.4
  rect 0.875x0.2 smd: 1(-3.575,2.8) 2(-3.575,2.4) 3(-3.575,2) 4(-3.575,1.6) 5(-3.575,1.2) 6(-3.575,0.8) 7(-3.575,0.4) 8(-3.575,0) 9(-3.575,-0.4) 10(-3.575,-0.8) 11(-3.575,-1.2) 12(-3.575,-1.6) 13(-3.575,-2) 14(-3.575,-2.4) 15(-3.575,-2.8) 31(3.575,-2.8) 32(3.575,-2.4) 33(3.575,-2.001) 34(3.575,-1.6) 35(3.575,-1.2) 36(3.575,-0.8) 37(3.575,-0.4) 38(3.575,-0.001) 39(3.575,0.4) 40(3.575,0.8) 41(3.575,1.2) 42(3.575,1.6) 43(3.575,2) 44(3.575,2.4) 45(3.575,2.8)
  rect 0.2x0.875 smd: 16(-2.8,-3.575) 17(-2.4,-3.575) 18(-2,-3.575) 19(-1.6,-3.575) 20(-1.2,-3.575) 21(-0.8,-3.575) 22(-0.4,-3.575) 23(0,-3.575) 24(0.4,-3.575) 25(0.8,-3.575) 26(1.2,-3.575) 27(1.6,-3.575) 28(2,-3.575) 29(2.4,-3.575) 30(2.8,-3.575) 46(2.8,3.575) 47(2.4,3.575) 48(2,3.575) 49(1.6,3.575) 50(1.2,3.575) 51(0.8,3.575) 52(0.4,3.575) 53(0,3.575) 54(-0.4,3.575) 55(-0.8,3.575) 56(-1.2,3.575) 57(-1.6,3.575) 58(-2,3.575) 59(-2.4,3.575) 60(-2.8,3.575)
  rect 3.4x3.4 smd: 61(0,0)
R0402
  rect 0.566x0.54 smd: 1(-0.433,0) 2(0.433,0)
R0603
  rect 0.806x0.864 smd: 1(-0.753,0) 2(0.753,0)
SOIC-8_L5.3-W5.3-P1.27-LS8.0-BL
  oval 0.63x2.25 smd: 1(-1.905,-3.53) 2(-0.635,-3.53) 3(0.635,-3.53) 4(1.905,-3.53) 5(1.905,3.53) 6(0.635,3.53) 7(-0.635,3.53) 8(-1.905,3.53)
SOT-23-6_L2.9-W1.6-P0.95-LS2.8-BR
  rect 1.1x0.6 smd: 1(1.35,-0.95) 2(1.35,0) 3(1.35,0.95) 4(-1.35,0.95) 5(-1.35,0) 6(-1.35,-0.95)
SOT-223-3_L6.5-W3.4-P2.30-LS7.0-BR
  rect 2.5x1.1 smd: 1(2.97,-2.3) 2(2.97,0) 3(2.97,2.3)
  rect 2.34x3.6 smd: 4(-2.97,0)
SW-SMD_L3.9-W3.0-P4.45
  rect 1.23x1.36 smd: 1(-2.185,0) 2(2.185,0)
SW-SMD_MSK12CO2
  rect 0.7x1.5 smd: 1(-1,1.45) 2(0,1.45) 3(1,1.45)
  rect 1x0.8 smd: 4(-2.75,0.75) 4(-2.75,-1.45) 5(2.75,0.75) 5(2.75,-1.45)
USB-C-SMD_TYPE-C-6PIN-2MD-073
  rect 0.55x1.1 smd: 1(-3.2,2.375) 2(-2.4,2.375) 11(2.4,2.375) 12(3.2,2.375)
  rect 0.3x1.1 smd: 3(-1.75,2.375) 4(-1.25,2.375) 5(-0.75,2.375) 6(-0.25,2.375) 7(0.25,2.375) 8(0.75,2.375) 9(1.25,2.375) 10(1.75,2.375)
  oval 1.1x2 hole 0.6x1.5: 13(-4.325,1.825) 14(4.325,1.825)
  oval 1.2x1.8 hole 0.6x1.2: 13(-4.325,-2.375) 14(4.325,-2.375)

## Nets
1V1: C9.2 C10.2 C11.2 C18.2 L1.1 U1.6 U1.23 U1.39 U1.50
GND: C1.1 C2.1 C3.1 C4.1 C5.1 C6.1 C7.1 C9.1 C10.1 C11.1 C12.1 C13.2 C14.2 C15.1 C16.1 C17.2 C18.1 C19.1 C20.2 C21.1 C22.1 C23.1 C24.1 D1.2 H1.1 H2.1 IMU.6 IMU.7 IMU.11 R1.1 R3.2 R4.2 R17.2 RGB.2 RGB.4 RGB.6 RGB.8 U1.47 U1.61 U2.4 U3.1 U4.2 U4.4 U5.1 U5.7 USB1.1 USB1.12 USB1.13 USB1.14 USB_BOOT.2
VBAT: H1.2 SW2.3
VBUS: D1.5 SW2.1 USB1.2 USB1.11
VCC: C1.2 C2.2 C3.2 C4.2 C5.2 C6.2 C7.2 C12.2 C14.1 C19.2 C20.1 C21.2 C22.2 C23.2 C24.2 H2.2 IMU.5 IMU.8 LED1.1 R8.2 U1.1 U1.11 U1.20 U1.30 U1.38 U1.44 U1.45 U1.49 U1.53 U1.54 U2.8 U3.2 U3.4 U5.6 U5.8
VIN: C13.1 SW2.2 U3.3
D+: D1.3 USB1.6 USB1.8
D-: D1.1 USB1.5 USB1.7
IMU_INT1: IMU.4 U1.9
IMU_INT2: IMU.9 U1.8
LED_B: R24.1 U1.34
LED_G: R23.1 U1.35
LED_R: R22.1 U1.36
LED_W: R25.1 U1.33
QSPI_SCLK: U1.56 U2.6
QSPI_SD0: U1.57 U2.5
QSPI_SD1: U1.59 U2.2
QSPI_SD2: U1.58 U2.3
QSPI_SD3: U1.55 U2.7
QSPI_SS: R2.2 U1.60 U2.1
RX: H2.4 U1.2
SPI1_CS: U1.28 U5.2
SPI1_MISO: U1.27 U5.5
SPI1_MOSI: U1.31 U5.3
SPI1_SCLK: U1.29 U5.4
SPI2_CS: IMU.12 U1.13
SPI2_MISO: IMU.1 U1.12
SPI2_MOSI: IMU.14 U1.15
SPI2_SCLK: IMU.13 U1.14
TX: H2.3 U1.3
USB_DM: D1.6 R6.1
USB_DP: D1.4 R7.1
XIN: C15.2 U1.21 U4.1
XOUT: C16.2 R5.2 U1.22
$3N2040: SW1.1 U1.26
$3N2079: R1.2 SW1.2
$3N3092: R2.1 USB_BOOT.1
$3N3395: R3.1 USB1.4
$3N3399: R4.1 USB1.10
$3N4615: R5.1 U4.3
$3N4980: R6.2 U1.51
$3N4984: R7.2 U1.52
$3N5159: C17.1 R8.1 U1.46
$3N5414: L1.2 U1.48
$3N15012: LED1.2 R17.1
$3N20270: R22.2 RGB.7
$3N20309: R23.2 RGB.5
$3N20348: R24.2 RGB.3
$3N20387: R25.2 RGB.1

Pads without a net: H1 3; IMU 2 3 10; SW2 4 5; U1 4 5 7 10 16 17 18 19 24 25 32 37 40 41 42 43; USB1 3 9

## Via types
v1: diameter 0.61, hole 0.305, Top Layer to Bottom Layer, 122 vias

## Routing (per net, layer and track width the routed paths; a pad name or vN(x,y) marks a point on that pad's centre or on a via; arc(x,y) is an arc through that point)
1V1: length 49.1
  Top Layer w0.15: 14.7,24.13 14.7,24.17 14.27,24.6 13.1,24.6 12.67,24.17 v1(12.67,24.16) ; U1.23 16.44,24.09 17.59,24.09 17.9,23.78 17.9,22.49 18.21,22.18 19.79,22.18 20.35,21.62 20.35,21.12
  Top Layer w0.254: C18.2 28.49,21.46 L1.1 26.86,21.53 26.86,21.65 26.16,22.35 24.71,22.35 24.1,22.97 23.56,22.97 ; v1(15.39,32.27) 15.9,32.78 21.33,32.78 21.39,32.72 21.43,32.72 21.59,32.55 21.59,30.91 20.63,29.96 C11.2 20.75,29.62 U1.6 ; 23.52,22.97 23.5,22.99 22.97,22.99 22.69,23.27 v1(22.24,23.27) ; 14.7,24.13 14.74,24.17 U1.23 ; v1(20.89,21.77) 20.53,21.41 20.53,21.31 20.35,21.12 U1.39 20.35,19.72 20.76,19.3 C9.2
  Bottom Layer w0.254: v1(22.24,23.27) 22.24,23.12 21.79,22.68 21.79,22.66 21.45,22.32 21.44,22.32 v1(20.89,21.77) ; v1(15.39,32.27) 14.83,31.71 12.78,31.71 11.82,30.75 11.82,29.88 13.12,28.59 14.88,28.59 15.06,28.41 15.06,26.55 v1(12.67,24.16)
GND: length 88.1
  Top Layer w0.15: 23.52,21.77 23.59,21.69 24.05,21.69 24.19,21.56 24.19,21.1 24.49,20.8 25.34,20.8 C17.2 ; v1(31.31,25.24) 31.31,25.29 30.78,25.81 30.77,25.8 28.66,25.8 28.39,25.53 C19.1
  Top Layer w0.254: U1.61 19.95,23.54 21.73,21.76 23.52,21.76 23.52,21.77 ; IMU.6 IMU.7 11.93,32.65 C24.1 11.86,32.67 v1(10.78,32.67) ; U4.2 11.75,22.26 13.61,24.13 ; U4.2 10.86,21.67 10.86,20.61 C15.1 ; U4.2 11.2,22.26 9.5,23.96 9.25,23.96 9.25,25.12 v1(9.25,25.12) ; v1(31.31,25.24) 32.32,24.23 U2.4 32.32,21.66 v1(32.33,21.65) ; v1(24.29,13.31) 24.29,13.32 R1.1 ; 16.78,6.21 16.78,7.24 R3.2 ; 16.78,6.21 16.2,5.63 USB1.13 ; 16.78,6.21 USB1.1 ; 7.98,17.23 7.94,17.2 7.94,16.46 ; 7.98,17.23 C20.2 8.75,17.23 9.75,18.23 U5.7 ; 7.98,17.23 C21.1 7.21,17.23 6.74,17.71 6.74,18.73 7.37,19.36 11.23,19.36 U5.1 ; RGB.4 5.49,3.14 v1(5.49,2.04) ; RGB.4 RGB.6 ; RGB.4 RGB.2 ; RGB.6 6.67,2.05 v1(6.68,2.04) ; RGB.6 RGB.8 ; C19.1 27.02,25.98 C6.1 ; C3.1 13.61,26.49 C16.1 12.98,27.12 12.95,27.12 12.73,27.35 11.71,27.35 11.17,26.81 v1(11.17,26.79) ; v1(27.58,17.94) 27.58,19.53 27.61,19.56 ; v1(12.65,6.57) 12.68,6.6 USB_BOOT.2 ; v1(5.57,13.74) 5.56,13.75 C14.2 ; C11.1 20.48,31.89 v1(19.36,31.89) ; C18.1 28.4,19.56 27.61,19.56 ; C17.2 27.61,19.56 ; C7.1 15.94,18.91 15.67,18.65 v1(15.67,18.62) ; IMU.11 10.13,29.66 9.92,29.86 C22.1 9.74,29.71 C23.1 8.49,29.7 v1(8.49,28.6) ; v1(22.8,16.72) 22.79,16.72 C5.1 ; v1(23.59,30.51) 23.59,30.52 22.67,30.52 ; C4.1 C9.1 20.76,16.74 v1(20.78,16.72) ; R17.2 19.18,13.4 v1(18.22,13.4) ; v1(22.1,9.86) 20.46,9.86 20,9.4 D1.2 ; USB1.14 23.78,6.19 USB1.12 23.2,7.27 R4.2 ; v1(15.1,31) 15.22,31.13 18.12,31.13 C2.1 ; v1(34.57,12.47) 34.57,13.69 C12.1
  Top Layer w2: U3.1 v1(6.17,24.21) v1(6.17,25.09) 6.17,26.18 C13.2
  vias: v1(1.58,28.43) v1(2.86,5.36) v1(2.86,2.86) v1(4.83,34.72) v1(5.13,30.87) v1(6.17,25.9) v1(7.29,33.36) v1(7.49,12.48) v1(7.93,26.83) v1(7.94,16.57) v1(10.04,12.45) v1(10.04,9.95) v1(10.04,7.45) v1(10.43,26.83) v1(10.36,2.86) v1(12.54,9.95) v1(12.86,2.86) v1(16.07,27.99) v1(17.54,14.95) v1(17.54,12.45) v1(18.68,25.45) v1(18.67,22.9) v1(21.21,25.45) v1(21.21,22.9) v1(24.39,11.37) v1(24.39,8.87) v1(24.53,31.94) v1(26.89,8.87) v1(26.89,6.37) v1(27.03,31.94) v1(27.39,2.86) v1(29.39,13.87) v1(29.39,11.37) v1(29.39,8.87) v1(29.53,34.44) v1(29.53,31.94) v1(29.89,5.36) v1(29.89,2.86) v1(30.34,16.02) v1(31.5,18.19) v1(31.89,13.87) v1(31.89,11.37) v1(32.03,34.44) v1(32.03,31.94) v1(32.39,7.86) v1(32.39,5.36) v1(32.39,2.86) v1(34.23,24.87) v1(34.26,20.13) v1(34.53,34.44) v1(34.53,31.94) v1(34.53,29.44) v1(34.89,10.36) v1(34.89,7.86) v1(34.89,5.36) v1(34.89,2.86) v1(35.44,24.78) v1(36.41,17.87)
VBAT: length 21.9
  Top Layer w0.25: 1.81,35.68 1.81,34.66 1.64,34.48 1.57,34.48 1.14,34.06 1.14,32.43
  Top Layer w0.75: SW2.3 3.55,31.38 2.7,31.38 2.14,31.95 1.62,31.95 1.15,32.42 ; 1.81,35.68 2.34,36.21 6.58,36.21 8.95,33.83 13.92,33.83 14.67,34.58 H1.2
VBUS: length 61.8
  Top Layer w0.254: 20,4.89 21.72,4.89 22.4,5.58 USB1.11 ; 20,4.89 18.31,4.89 17.6,5.6 USB1.2 ; 20,4.89 20,4.27 19.53,3.8 14.85,3.8 13.98,4.67 13.98,6.68 16.25,8.95 ; v1(5.75,33.3) 3.71,33.3 SW2.1 ; 16.25,8.95 16.25,12.25 v1(14.6,13.89) ; 16.25,8.95 17.5,10.2 19.62,10.2 20,10.58 D1.5
  Bottom Layer w0.254: v1(14.6,13.89) 7.18,13.89 2.99,18.08 2.99,30.54 v1(5.75,33.3)
VCC: length 185.6
  Top Layer w0.15: 16.37,21.37 16.38,21.35 19.27,21.35 19.53,21.61 ; 12.88,27.7 8.2,27.7 7.41,28.49 7.41,30.03 C23.2 ; v1(17.53,25.39) 16.96,25.39 16.9,25.44 16.44,25.44 16.37,25.37 ; C24.2 12.87,32.69 12.37,33.2 10.56,33.2 10.06,32.69 10.05,32.69 9.89,32.53 9.89,31.16
  Top Layer w0.254: C1.2 22.99,29.28 v1(23.88,29.28) ; U1.44 U1.45 22.75,19.8 ; 12.88,27.7 13.71,27.7 14.7,26.71 14.7,25.4 14.74,25.37 16.37,25.37 ; v1(13.93,16.88) 13.93,17.42 15.05,18.53 15.05,19.95 C7.2 15.81,20.71 15.81,21.21 15.94,21.34 ; 2.06,14.86 2.06,7.77 4.51,5.32 11.94,5.32 14.3,2.95 26.21,2.95 35.94,12.68 C12.2 36.13,13.91 U2.8 ; v1(22.78,19.8) 22.78,18.91 22.75,18.88 C5.2 23.72,17.91 R8.2 ; v1(22.51,22.51) 22.58,22.51 22.64,22.57 U1.49 ; v1(28.12,27.02) 27.34,27.8 26.68,27.8 C6.2 25.93,25.98 C19.2 24.52,24.57 U1.54 U1.53 ; 10.93,17.64 10.93,18.64 10.71,18.85 10.28,18.85 U5.8 9.25,18.88 8.7,18.33 C20.1 C21.2 ; 22.67,29.43 22.75,29.35 U1.1 ; IMU.8 11.17,31.16 9.89,31.16 C22.2 9.74,31.11 C23.2 ; LED1.1 18.95,18.16 C4.2 19.62,19.3 19.95,19.63 U1.38 19.95,21.12 19.53,21.54 19.53,21.61 ; IMU.5 12.93,32.65 C24.2 14.7,32.69 15.84,33.84 20.82,33.84 H2.2 ; C2.2 18.75,29.41 U1.11 18.77,27.72 18.77,27.19 19.36,26.59 v1(19.36,26.54) ; U5.6 10.28,17.55 v1(10.93,17.55)
  Top Layer w2: C14.1 3.87,16.67 v1(3.87,21.2) v1(3.87,22.17) U3.2
  Bottom Layer w0.15: 27.92,25.85 27.92,26.81 v1(28.12,27.02) ; v1(19.36,26.54) 19.77,26.14 21.27,26.14 21.63,26.49 21.72,26.49 21.88,26.34 22.52,26.34 23.01,25.85 24.5,25.85 ; 18.97,26.15 18.67,26.15 18.54,26.03 18.17,26.03 v1(17.53,25.39)
  Bottom Layer w0.254: v1(19.53,21.63) 21.36,19.8 v1(22.78,19.8) 22.51,20.07 v1(22.51,22.51) 28.44,22.51 30.3,24.36 31.46,24.36 31.91,24.82 31.91,25.59 31.65,25.85 29.9,25.85 29.9,25.85 29.41,25.85 29.41,25.85 24.5,25.85 23.88,26.47 v1(23.88,29.28) ; v1(3.86,20.3) 6.6,17.55 v1(10.93,17.55) 13.26,17.55 v1(13.93,16.88) ; v1(19.36,26.54) 19.36,26.51 19.01,26.15 18.97,26.15
  vias: v1(19.57,19.35)
VIN: length 13.3
  Top Layer w0.75: C13.1 5.23,29.84 5.97,29.84 6.5,30.37 6.5,31.55 5.79,32.26 SW2.2
  Top Layer w2: C13.1 1.57,26.18 U3.3
D+: length 4.5
  Top Layer w0.254: 20.76,6.84 20.76,7.59 20.95,7.79 D1.3 ; 20.76,6.84 20.76,6.19 USB1.8 ; 20.76,6.84 20.69,6.84 20.52,7.01 19.98,7.01 19.75,6.78 USB1.6
D-: length 5.2
  Top Layer w0.254: D1.1 19.25,8.61 USB1.5 19.32,6.11 19.32,5.52 19.48,5.36 20.11,5.36 20.25,5.5 20.25,6.18 USB1.7
IMU_INT1: length 9.5
  Top Layer w0.254: U1.9 19.55,30.8 18.69,31.66 14.19,31.66 IMU.4
IMU_INT2: length 13.7
  Top Layer w0.254: IMU.9 12.14,30.66 v1(12.44,30.36) ; v1(20.75,26.69) 20.42,26.69 19.95,27.16 U1.8
  Bottom Layer w0.254: v1(20.75,26.69) 20.75,27.8 17.98,30.58 17.23,30.58 17.22,30.58 16.74,30.58 16.73,30.58 16.34,30.58 16.12,30.36 v1(12.44,30.36)
LED_B: length 17.9
  Top Layer w0.254: U1.34 18.35,19.96 14.33,15.94 9.36,15.94 5.3,11.88 R24.1
LED_G: length 17.5
  Top Layer w0.254: U1.35 18.75,19.85 14.48,15.58 9.55,15.58 6.7,12.73 R23.1
LED_R: length 17
  Top Layer w0.254: U1.36 19.15,19.75 14.62,15.22 9.73,15.22 8.1,13.59 R22.1
LED_W: length 18.3
  Top Layer w0.254: U1.33 17.93,20.57 17.93,20.04 14.18,16.29 9.19,16.29 R25.1
QSPI_SCLK: length 19.9
  Top Layer w0.15: v1(22.28,25) 22.57,25 22.73,25.16 22.86,25.16 23.08,25.38 23.51,25.38 23.52,25.37
  Top Layer w0.254: v1(29.65,25.27) 29.65,24.09 30.87,22.88 30.87,20.17 33.59,17.45 U2.6
  Bottom Layer w0.254: v1(22.28,25) 22.6,25 22.92,24.68 29.12,24.68 29.46,25.02 29.46,25.08 v1(29.65,25.27)
QSPI_SD0: length 18.6
  Top Layer w0.254: v1(28.88,25.27) 28.88,24.24 30.46,22.67 30.46,18.02 U2.5 ; 23.52,25.77 22.34,25.77 v1(22.29,25.81)
  Bottom Layer w0.254: v1(28.88,25.27) 22.84,25.27 v1(22.29,25.81)
QSPI_SD1: length 16.5
  Top Layer w0.254: U1.59 24.05,26.57 24.24,26.75 24.24,27.27 26.18,29.21 31.12,29.21 34.86,25.46 34.86,23.21
QSPI_SD2: length 15.2
  Top Layer w0.254: U1.58 24.31,26.17 24.35,26.21 24.38,26.21 24.66,26.48 24.66,26.98 26.33,28.66 30.85,28.66 33.59,25.92 U2.3
QSPI_SD3: length 20.9
  Top Layer w0.15: v1(22.34,24.24) 22.86,24.76 ; 22.86,24.76 23.07,24.97 23.51,24.97 23.52,24.97
  Top Layer w0.254: v1(30.45,25.23) 30.45,24.02 31.28,23.19 31.28,20.44 34.86,16.86 34.86,16.16
  Bottom Layer w0.254: v1(30.45,25.23) 30.23,25.01 30.22,25.01 29.88,24.67 29.75,24.67 29.32,24.24 v1(22.34,24.24)
QSPI_SS: length 63.2
  Top Layer w0.254: R2.2 15.68,9.19 13.47,6.99 13.47,4.4 14.49,3.38 25.62,3.38 32.9,10.67 32.9,13.55 33.88,14.54 35.04,14.54 35.47,14.96 35.47,18.02 36.13,18.68 U2.1 36.13,24.93 31.32,29.74 26.01,29.74 23.52,27.26 23.52,26.97
RX: length 11.1
  Top Layer w0.15: U1.2 22.35,32.11 22.61,32.37
  Top Layer w0.254: H2.4 26.03,33.97 24.21,33.97 22.61,32.37
SPI1_CS: length 7.7
  Top Layer w0.254: U5.2 12.27,18.23 13.03,18.98 13.03,21.39 13.8,22.17 U1.28
SPI1_MISO: length 21.3
  Top Layer w0.254: U5.5 9.33,16.93 8.38,15.99 7.08,15.99 6.26,16.81 6.26,19.07 7.17,19.98 v1(8.81,19.98) ; v1(17.57,21.9) 17.54,21.94 17.18,21.94 17.13,21.98 17.13,22.34 16.89,22.58 16.39,22.58 U1.27
  Bottom Layer w0.254: v1(8.81,19.98) 10.6,21.77 14.22,21.77 14.51,22.06 14.99,22.06 15.16,21.9 v1(17.57,21.9)
SPI1_MOSI: length 6.9
  Top Layer w0.254: U5.3 12.18,17.58 14.02,19.42 v1(14.47,19.42) ; v1(16.63,20.06) 17,20.06 17.15,20.21 U1.31
  Bottom Layer w0.254: v1(14.47,19.42) 15.99,19.42 v1(16.63,20.06)
SPI1_SCLK: length 8.2
  Top Layer w0.254: v1(14.75,21.48) 15.03,21.77 16.37,21.77 ; v1(13.97,18.28) 12.62,16.93 U5.4
  Bottom Layer w0.254: v1(13.97,18.28) 13.88,18.38 13.88,20.62 v1(14.75,21.48)
SPI2_CS: length 8.1
  Top Layer w0.254: U1.13 17.95,28.28 17.38,28.84 16.04,28.84 15.25,28.05 12.45,28.05 11.93,28.57 IMU.12
SPI2_MISO: length 7.2
  Top Layer w0.254: IMU.1 14.63,29.66 15.57,30.6 17.21,30.6 18.13,29.67 18.13,28.97 18.34,28.75 18.35,28.75 U1.12
SPI2_MOSI: length 9.5
  Top Layer w0.254: U1.15 17.15,26.75 v1(17.37,26.53) ; IMU.14 13.18,29.15 14.85,29.15 15.7,30 v1(16.98,30)
  Bottom Layer w0.254: v1(17.37,26.53) 16.96,26.93 16.96,29.98 v1(16.98,30)
SPI2_SCLK: length 10.7
  Top Layer w0.254: v1(18.16,26.56) 17.55,27.17 17.55,27.74 ; v1(17.55,29.41) 15.9,29.41 15.03,28.55 12.7,28.55 12.43,28.81 IMU.13
  Bottom Layer w0.254: v1(18.16,26.56) 18.16,28.8 v1(17.55,29.41)
TX: length 9.1
  Top Layer w0.254: H2.3 21.95,32.43 U1.3
USB_DM: length 22.5
  Top Layer w0.254: D1.6 19.05,11.8 20,12.75 21.41,12.75 22.34,13.68 22.34,15.12 24.48,17.26 28.6,17.26 29.63,18.3 29.63,22.32 28.97,22.99 R6.1
USB_DP: length 21.9
  Top Layer w0.254: D1.4 20.95,11.68 22.78,13.51 22.78,14.94 24.69,16.85 28.77,16.85 30.03,18.11 30.03,22.49 28.52,24 R7.1
XIN: length 14.6
  Top Layer w0.254: 16.37,24.97 16.39,24.95 16.93,24.95 17.25,24.62 v1(17.59,24.62) ; v1(15.13,23.18) 13.33,23.18 12.61,22.47 12.61,20.85 11.69,19.92 10.45,19.92 C15.2 9.8,21.71 U4.1
  Bottom Layer w0.254: v1(17.59,24.62) 17.59,24.07 16.69,23.18 v1(15.13,23.18)
XOUT: length 6.2
  Top Layer w0.15: 12.6,24.85 15.34,24.85
  Top Layer w0.254: 15.34,24.85 15.63,24.57 U1.22 ; C16.2 11.92,26.5 R5.2 12.6,24.85
$3N2040: length 18.9
  Top Layer w0.254: v1(17.35,22.95) 17.33,22.97 16.37,22.97 ; v1(27.36,11.69) 27.36,10.27 SW1.1
  Bottom Layer w0.254: v1(27.36,11.69) 27.36,12.5 25.24,14.63 23.32,14.63 21.74,16.2 21.74,18.56 v1(17.35,22.95)
$3N2079: length 2.4
  Top Layer w0.254: R1.2 26.93,14.19 SW1.2
$3N3092: length 2.4
  Top Layer w0.254: 14.81,11.66 14.2,12.28 USB_BOOT.1
$3N3395: length 1.7
  Top Layer w0.254: USB1.4 18.75,6.89 R3.1
$3N3399: length 1.5
  Top Layer w0.254: USB1.10 21.75,7.39 R4.1
$3N4615: length 1.7
  Top Layer w0.254: 11.45,23.96 11.45,24.3 11.06,24.69 R5.1
$3N4980: length 1.7
  Top Layer w0.254: 23.52,23.37 24.32,23.37 24.7,22.99 R6.2
$3N4984: length 1.6
  Top Layer w0.254: R7.2 24.57,24 24.34,23.77 23.52,23.77
$3N5159: length 4.5
  Top Layer w0.254: R8.1 26.02,18.12 C17.1 24.59,19.8 23.52,20.86 23.52,21.37
$3N5414: length 2.2
  Top Layer w0.254: L1.2 24.83,21.46 24.12,22.17 U1.48
$3N15012: length 1.8
  Top Layer w0.254: LED1.2 21.05,13.76 R17.1
$3N20270: length 1.9
  Top Layer w0.254: R22.2 8.1,9.14 7.88,8.93 7.88,7.71 RGB.7
$3N20309: length 1.8
  Top Layer w0.254: RGB.5 6.7,7.72 R23.2
$3N20348: length 1.9
  Top Layer w0.254: R24.2 5.47,9.34 RGB.3
$3N20387: length 2
  Top Layer w0.254: RGB.1 4.27,9.14 R25.2

## Copper pours and planes (outline as drawn; the poured copper is in the pictures)
GND on Top Layer: -2.83,38.79 35.85,38.79 39.76,34.88 39.76,0.41 36.15,-3.21 1.91,-3.21 -2.83,1.53
GND on Bottom Layer: -3.54,40.64 38,40.64 41.39,37.25 41.39,0.6 36.72,-4.07 -0.83,-4.07 -4.37,-0.53 -4.37,39.81
